# EAGLE design Shruthi-Analog-SSM2044-v02 (EAGLE 5.09)
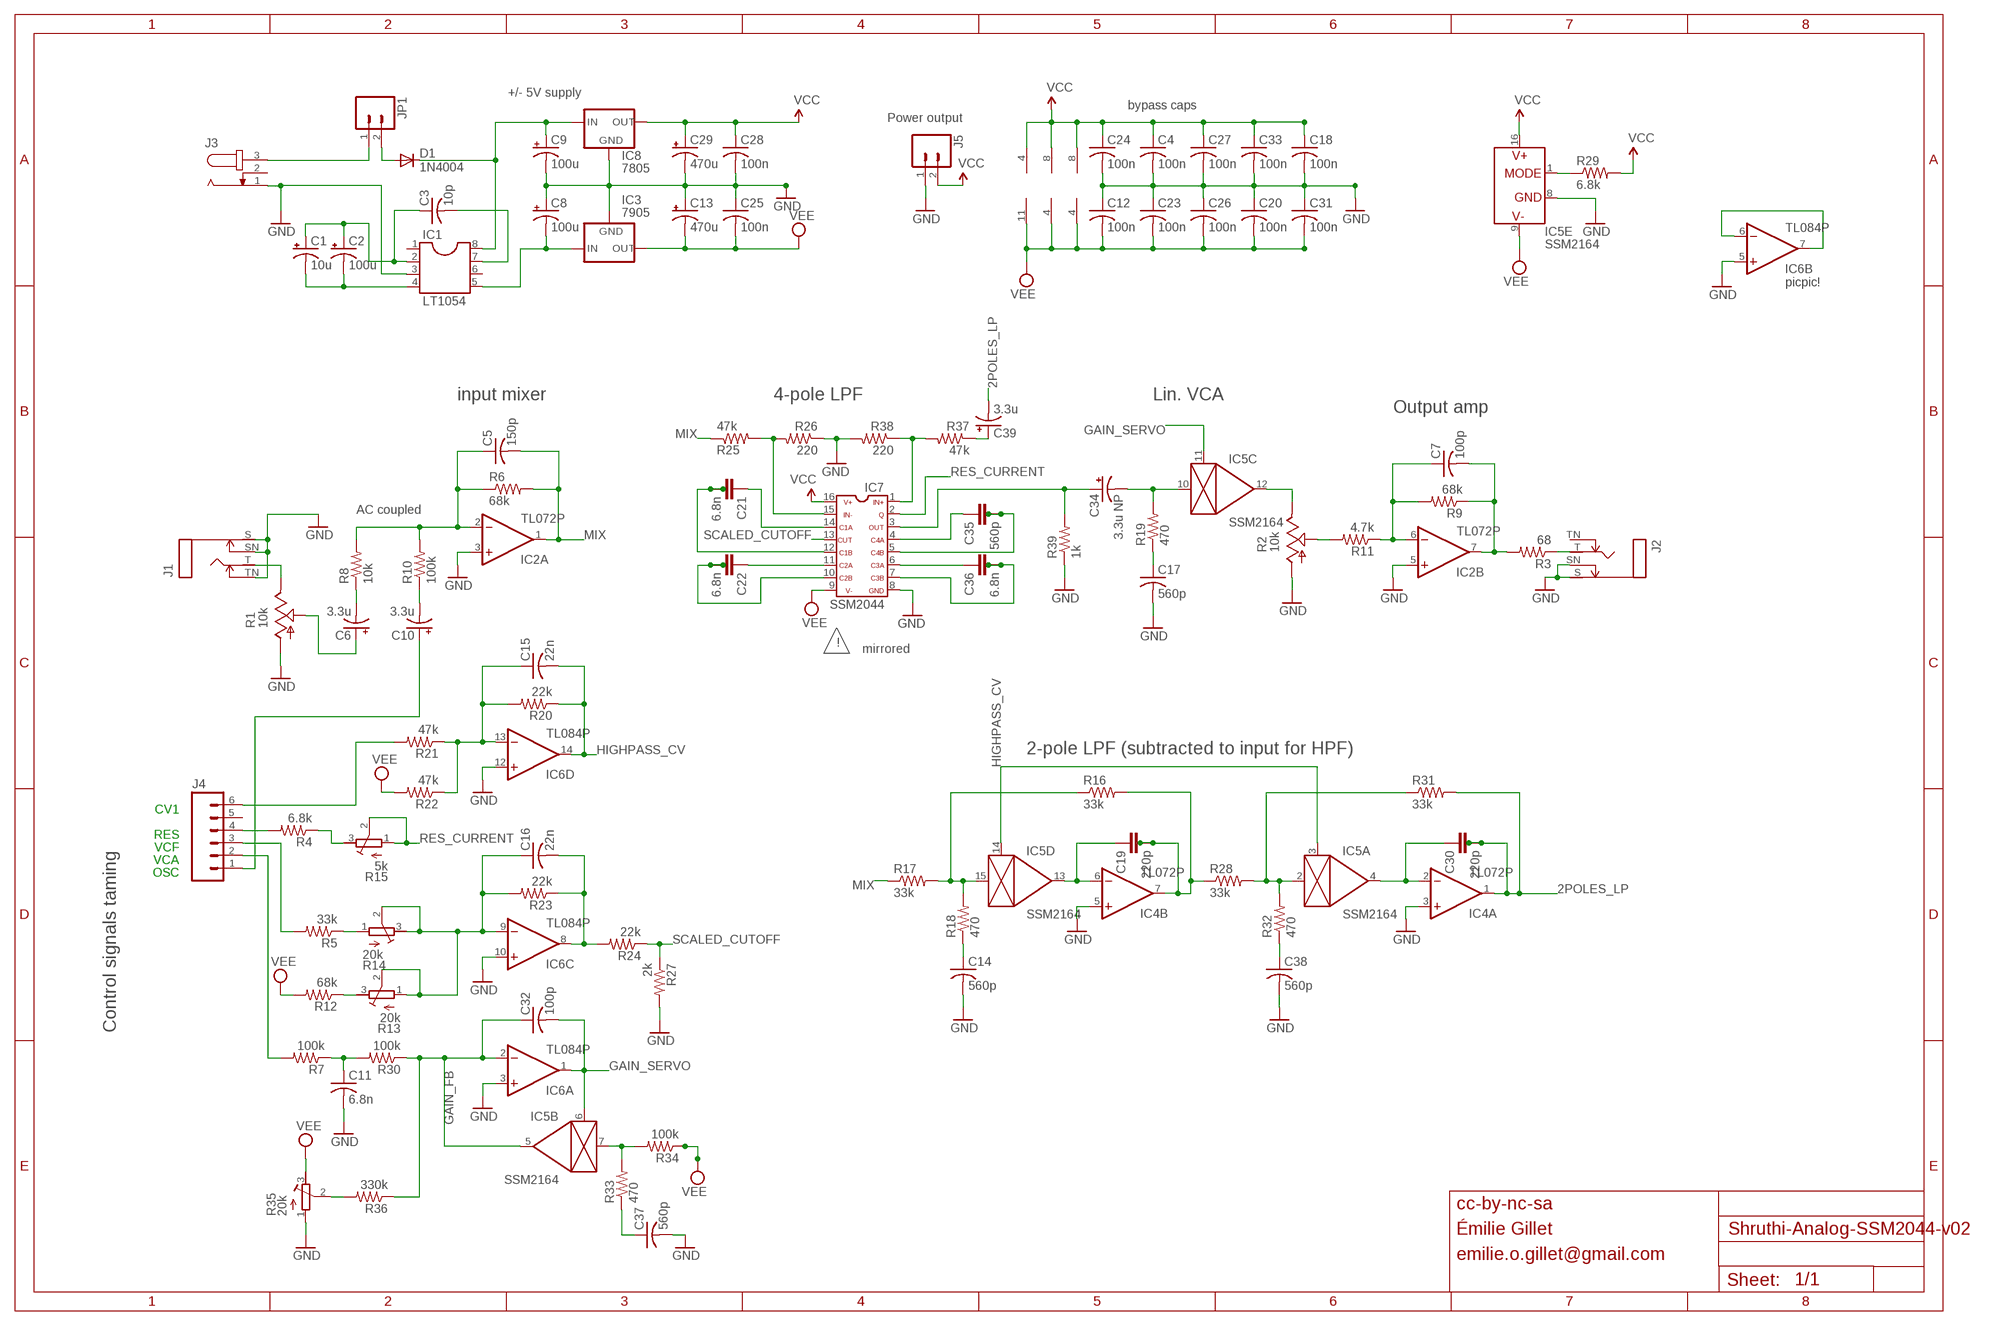
[diagram p0: schematic, sheet 1]

## Parts
C1  10u  CPOL-USE2.5-5  [E2,5-5]
C2  100u  CPOL-USE2.5-6  [E2,5-6]
C3  10p  C-US025-025X050  [C025-025X050]
C4  100n  C-US025-025X050  [C025-025X050]
C5  150p  C-US025-025X050  [C025-025X050]
C6  3.3u  CPOL-USE2.5-6  [E2,5-6]
C7  100p  C-US025-025X050  [C025-025X050]
C8  100u  CPOL-USE2.5-7  [E2,5-7]
C9  100u  CPOL-USE2.5-7  [E2,5-7]
C10  3.3u  CPOL-USE2.5-6  [E2,5-6]
C11  6.8n  C-US050-025X075  [C050-025X075]
C12  100n  C-US025-025X050  [C025-025X050]
C13  470u  CPOL-USE5-10.5  [E5-10,5]
C14  560p  C-US025-025X050  [C025-025X050]
C15  22n  C-US050-025X075  [C050-025X075]
C16  22n  C-US050-025X075  [C050-025X075]
C17  560p  C-US025-025X050  [C025-025X050]
C18  100n  C-US025-025X050  [C025-025X050]
C19  220p  C-2.5-5/4  [C2.5/5-4]
C20  100n  C-US025-025X050  [C025-025X050]
C21  6.8n  C-2.5-5/4  [C2.5/5-4]
C22  6.8n  C-2.5-5/4  [C2.5/5-4]
C23  100n  C-US025-025X050  [C025-025X050]
C24  100n  C-US025-025X050  [C025-025X050]
C25  100n  C-US025-025X050  [C025-025X050]
C26  100n  C-US025-025X050  [C025-025X050]
C27  100n  C-US025-025X050  [C025-025X050]
C28  100n  C-US025-025X050  [C025-025X050]
C29  470u  CPOL-USE5-10.5  [E5-10,5]
C30  220p  C-2.5-5/4  [C2.5/5-4]
C31  100n  C-US025-025X050  [C025-025X050]
C32  100p  C-US025-025X050  [C025-025X050]
C33  100n  C-US025-025X050  [C025-025X050]
C34  3.3u NP  CPOL-USE2.5-6  [E2,5-6]
C35  560p  C-2.5-5/4  [C2.5/5-4]
C36  6.8n  C-2.5-5/4  [C2.5/5-4]
C37  560p  C-US025-025X050  [C025-025X050]
C38  560p  C-US025-025X050  [C025-025X050]
C39  3.3u  CPOL-USE2.5-6  [E2,5-6]
D1  1N4004  [DO41-10]
IC1  LT1054  DIL8  [DIL08]
IC2  TL072P  [DIL08]
IC3  7905  79XXS  [79XXS]
IC4  TL072P  [DIL08]
IC5  SSM2164  SSM2164P  [DIL16]
IC6  TL084P  [DIL14]
IC7  SSM2044  SSM2044SOCKETED  [SOCKET-16]
IC8  7805  78XXS  [78XXS]
J1  MONOSWS  [NMJ4HC-S]
J2  MONOSWS  [NMJ4HC-S]
J3  JACK-PLUG  [SPC4078_LARGER_HOLES]
J4  M06SIP  [1X06]
J5  M02PTH  [1X02]
JP1  M02  [1X02_LONGPADS]
R1  10k  POT_USCABLED  [CABLE_POT_6MM]
R2  10k  POT_USCABLED  [CABLE_POT_6MM]
R3  68  R-US_0204/7  [0204/7]
R4  6.8k  R-US_0204/7  [0204/7]
R5  33k  R-US_0204/7  [0204/7]
R6  68k  R-US_0204/7  [0204/7]
R7  100k  R-US_0204/7  [0204/7]
R8  10k  R-US_0204/7  [0204/7]
R9  68k  R-US_0204/7  [0204/7]
R10  100k  R-US_0204/7  [0204/7]
R11  4.7k  R-US_0204/7  [0204/7]
R12  68k  R-US_0204/7  [0204/7]
R13  20k  R-TRIMM3296W  [RTRIM3296W]
R14  20k  R-TRIMM3296W  [RTRIM3296W]
R15  5k  R-TRIMM3296W  [RTRIM3296W]
R16  33k  R-US_0204/7  [0204/7]
R17  33k  R-US_0204/7  [0204/7]
R18  470  R-US_0204/7  [0204/7]
R19  470  R-US_0204/7  [0204/7]
R20  22k  R-US_0204/7  [0204/7]
R21  47k  R-US_0204/7  [0204/7]
R22  47k  R-US_0204/7  [0204/7]
R23  22k  R-US_0204/7  [0204/7]
R24  22k  R-US_0204/7  [0204/7]
R25  47k  R-US_0204/7  [0204/7]
R26  220  R-US_0204/7  [0204/7]
R27  2k  R-US_0204/7  [0204/7]
R28  33k  R-US_0204/7  [0204/7]
R29  6.8k  R-US_0204/7  [0204/7]
R30  100k  R-US_0204/7  [0204/7]
R31  33k  R-US_0204/7  [0204/7]
R32  470  R-US_0204/7  [0204/7]
R33  470  R-US_0204/7  [0204/7]
R34  100k  R-US_0204/7  [0204/7]
R35  20k  R-TRIMM3296W  [RTRIM3296W]
R36  330k  R-US_0204/7  [0204/7]
R37  47k  R-US_0204/7  [0204/7]
R38  220  R-US_0204/7  [0204/7]
R39  1k  R-US_0204/7  [0204/7]

## Nets
2POLES_LP: C30.2 C30.3 C39.- IC4.1(A:OUT) R31.2
GAIN_FB: C32.1 IC5.5(B:OUT) IC6.2(A:-IN) R30.1 R36.1
GAIN_SERVO: C32.2 IC5.6(B:CTRL) IC5.11(C:CTRL) IC6.1(A:OUT)
GND: C4.2 C8.+ C9.- C11.2 C12.1 C13.+ C14.2 C17.2 C18.2 C20.1 C23.1 C24.2 C25.1 C26.1 C27.2 C28.2 C29.- C31.1 C33.2 C37.2 C38.2 IC1.3 IC2.3(A:+IN) IC2.5(B:+IN) IC3.GND IC4.3(A:+IN) IC4.5(B:+IN) IC5.8(E:GND) IC6.3(A:+IN) IC6.5(B:+IN) IC6.10(C:+IN) IC6.12(D:+IN) IC7.8 IC8.GND J1.S J1.SN J1.TN J2.S J2.SN J3.1 J5.1 R1.A R2.A R26.1 R27.2 R35.1(E) R38.2 R39.1
HIGHPASS: C19.2 C19.3 IC4.7(B:OUT) R16.2 R28.1
HIGHPASS_CV: C15.2 IC5.3(A:CTRL) IC5.14(D:CTRL) IC6.14(D:OUT) R20.1
LOWPASS: C34.+ IC7.3 R39.2
MIX: C5.2 IC2.1(A:OUT) R6.2 R17.1 R25.1
N$1: C1.+ C2.+ C3.1 IC1.2
N$2: IC5.1(E:MODE) R29.1
N$3: J3.3 JP1.1
N$4: C9.+ D1.C IC1.8 IC8.IN
N$5: C1.- C2.- IC1.4
N$6: R2.S R11.2
N$7: J4.2 R7.2
N$8: C11.1 R7.1 R30.2
N$9: C34.- IC5.10(C:IN) R19.2
N$10: J4.4 R4.2
N$11: J4.3 R5.2
N$12: R12.1 R13.3(A)
N$13: R5.1 R14.1(E)
N$14: IC7.1 R37.2 R38.1
N$16: C16.2 IC6.8(C:OUT) R23.1 R24.2
N$17: C16.1 IC6.9(C:-IN) R13.1(E) R13.2(S) R14.2(S) R14.3(A) R23.2
N$18: J4.6 R21.2
N$19: C19.1 IC4.6(B:-IN) IC5.13(D:OUT)
N$20: C15.1 IC6.13(D:-IN) R20.2 R21.1 R22.1
N$21: C35.2 C35.3 IC7.5
N$22: C36.1 IC7.6
N$23: C22.1 IC7.11
N$24: R4.1 R15.3(A)
N$25: C35.1 IC7.4
N$26: C38.1 R32.1
N$27: C22.2 C22.3 IC7.10
N$28: C39.+ R37.1
N$29: C21.2 C21.3 IC7.12
N$30: IC7.15 R25.2 R26.2
N$31: C17.1 R19.1
N$32: C36.2 C36.3 IC7.7
N$33: IC5.15(D:IN) R16.1 R17.2 R18.2
N$34: IC5.12(C:OUT) R2.E
N$35: C10.+ J4.1
N$36: C3.2 IC1.7
N$37: C5.1 IC2.2(A:-IN) R6.1 R8.2 R10.2
N$38: J1.T R1.E
N$39: C10.- R10.1
N$40: C14.1 R18.1
N$41: IC5.7(B:IN) R33.2 R34.2
N$42: C37.1 R33.1
N$43: IC5.2(A:IN) R28.2 R31.1 R32.2
N$44: C21.1 IC7.14
N$45: R35.2(S) R36.2
N$46: C30.1 IC4.2(A:-IN) IC5.4(A:OUT)
N$47: J2.T R3.1
N$48: IC6.6(B:-IN) IC6.7(B:OUT)
N$58: C8.- IC1.5 IC3.IN
N$59: D1.A JP1.2
N$63: C7.2 IC2.7(B:OUT) R3.2 R9.1
N$66: C6.+ R1.S
N$70: C7.1 IC2.6(B:-IN) R9.2 R11.1
N$72: C6.- R8.1
RES_CURRENT: IC7.2 R15.1(E) R15.2(S)
SCALED_CUTOFF: IC7.13 R24.1 R27.1
VCC: C4.1 C18.1 C24.1 C27.1 C28.1 C29.+ C33.1 IC2.8(P:V+) IC4.8(P:V+) IC5.16(E:V+) IC6.4(P:V+) IC7.16 IC8.OUT J5.2 R29.2
VEE: C12.2 C13.- C20.2 C23.2 C25.2 C26.2 C31.2 IC2.4(P:V-) IC3.OUT IC4.4(P:V-) IC5.9(E:V-) IC6.11(P:V-) IC7.9 R12.2 R22.2 R34.1 R35.3(A)
Unconnected: IC1.1 IC1.6 J2.TN J3.2 J4.5

## Notes on the sheet
- +/- 5V supply
- bypass caps
- Power output
- picpic!
- input mixer | 4-pole LPF | Lin. VCA
- Output amp
- AC coupled
- !
- mirrored
- 2-pole LPF (subtracted to input for HPF)
- CV1
- RES
- VCF
- VCA
- OSC
- Control signals taming
- cc-by-nc-sa
- Émilie Gillet
- emilie.o.gillet@gmail.com

## Library data of the parts
C1 C2 C6 C8-C10 C13 C29 C34 C39 = rcl:CPOL-US: POLARIZED CAPACITOR, American symbol
C3-C5 C7 C11 C12 C14-C18 C20 C23-C28 C31-C33 C37 C38 = rcl:C-US: CAPACITOR, American symbol
C19 C21 C22 C30 C35 C36 = capacitor-wima:C-: CAPACITOR for alternative placement naming: default grid - extended grid/package width
D1 = diode:1N4004: DIODE general purpose rectifier, 1 A
IC1 = ic-package:DIL8: Dual In Line / Socket
IC2 IC4 = linear:TL072: OP AMP
IC3 = v-reg:79XXS: VOLTAGE REGULATOR
IC5 = ssm2164:SSM2164
IC6 = linear:TL084: OP AMP
IC7 = ssm:SSM2044: 4-pole VCF with VC-controlled resonance
IC8 = v-reg:78XXS: VOLTAGE REGULATOR
J1 J2 = gm-jacks:MONOSW
J3 = con-jack2:JACK-PLUG: DC POWER JACK Power Jack, DC, Right Angle, Through Hole, Rated 5A at 16VDC, PC Terminals Distributor: Farnell (www.Farnell.de) Drawing: 84N1161.pdf / 84N1162.pdf Manufacturer: SPC Technology (www.spctechnology.com) Type: SPC4077 / SPC 4078
J4 = SparkFun:M06: Header 6 Standard 6-pin 0.1" header. Use with straight break away headers (SKU : PRT-00116), right angle break away headers (PRT-00553), swiss pins (PRT-00743), machine pins (PRT-00117), and female headers (PRT-00115). Molex polarized connector foot print use with SKU : PRT-08094 with associated crimp pins and housings. NOTES ON THE VARIANTS LOCK and LOCK_LONGPADS... This footprint was designed to help hold the alignment of a through-hole component (i.e. 6-pin header) while soldering it into place. You may notice that each hole has been shifted either up or down by 0.005 of an inch from it's more standard position (which is a perfectly straight line). This slight alteration caused the pins (the squares in the middle) to touch the edges of the holes. Because they are alternating, it causes a "brace" to hold the component in place. 0.005 has proven to be the perfect amount of "off-center" position when using our standard breakaway headers. Although looks a little odd when you look at the bare footprint, once you have a header in there, the alteration is very hard to notice. Also, if you push a header all the way into place, it is covered up entirely on the bottom side. This idea of altering the position of holes to aid alignment will be further integrated into the Sparkfun Library for other footprints. It can help hold any component with 3 or more connection pins.
J5 JP1 = SparkFun:M02: Header 2 Standard 2-pin 0.1" header. Use with straight break away headers (SKU : PRT-00116), right angle break away headers (PRT-00553), swiss pins (PRT-00743), machine pins (PRT-00117), and female headers (PRT-00115). Molex polarized connector foot print use with SKU : PRT-08233 with associated crimp pins and housings.
R1 R2 = pot-cable:POT_US
R3-R12 R16-R34 R36-R39 = rcl:R-US_: RESISTOR, American symbol
R13-R15 R35 = rcl:R-TRIMM: Trimm resistor

## Board
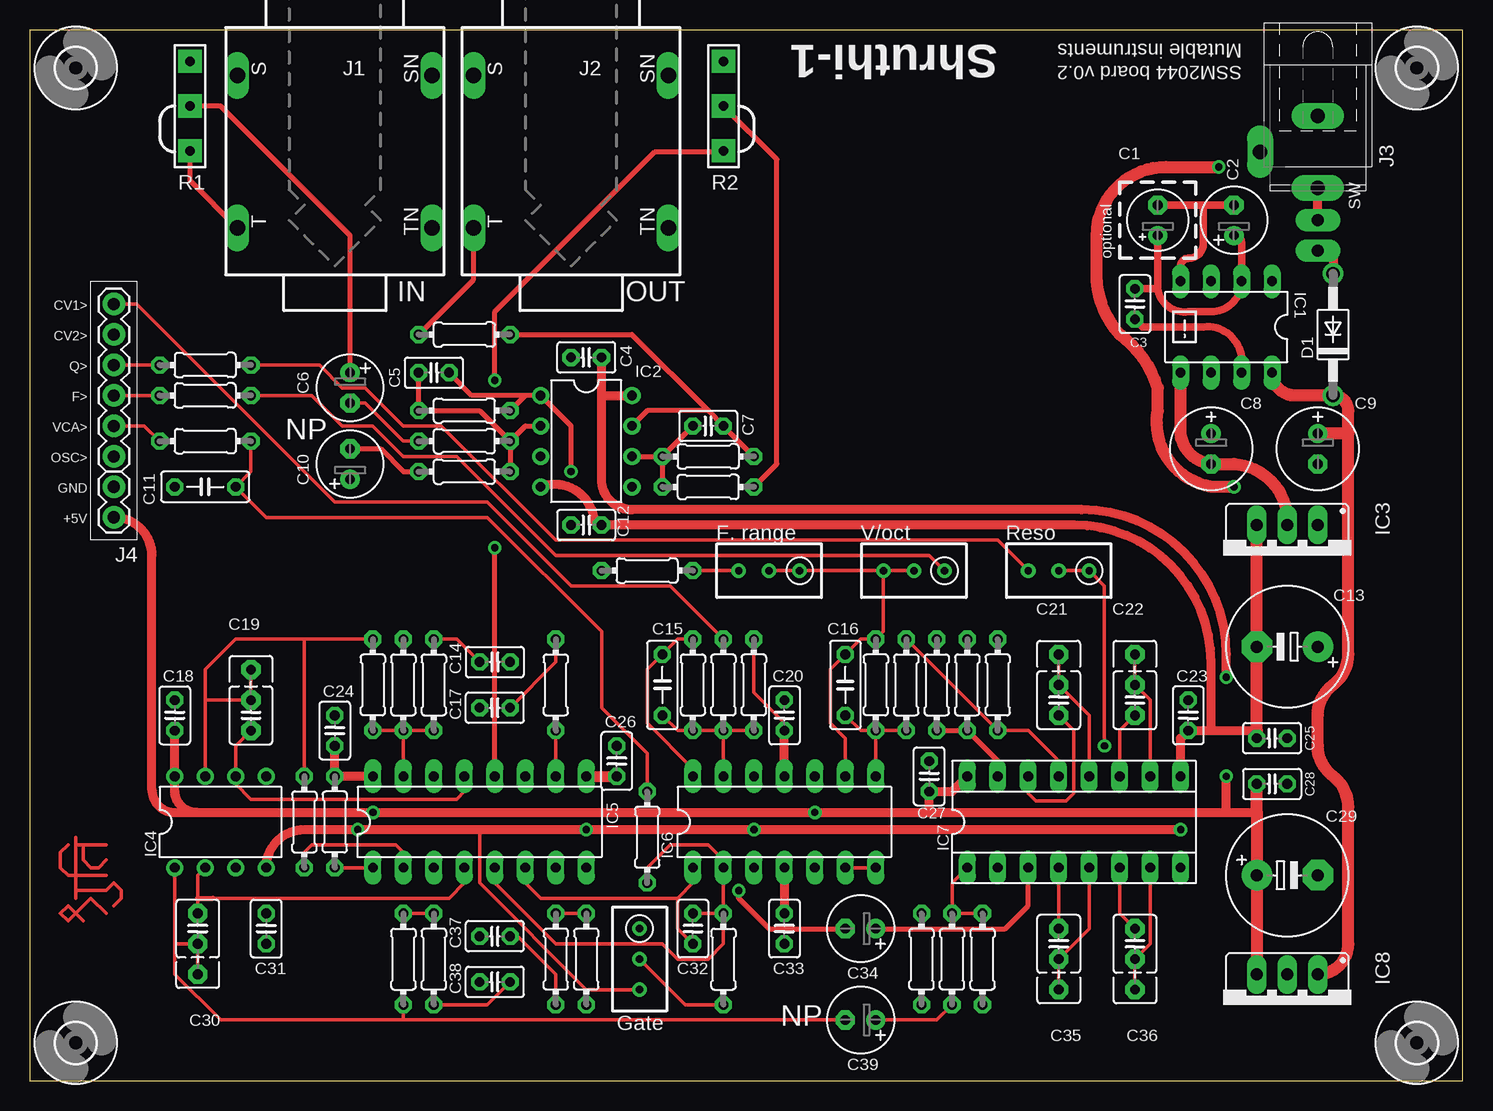
[diagram p1: board, top side]
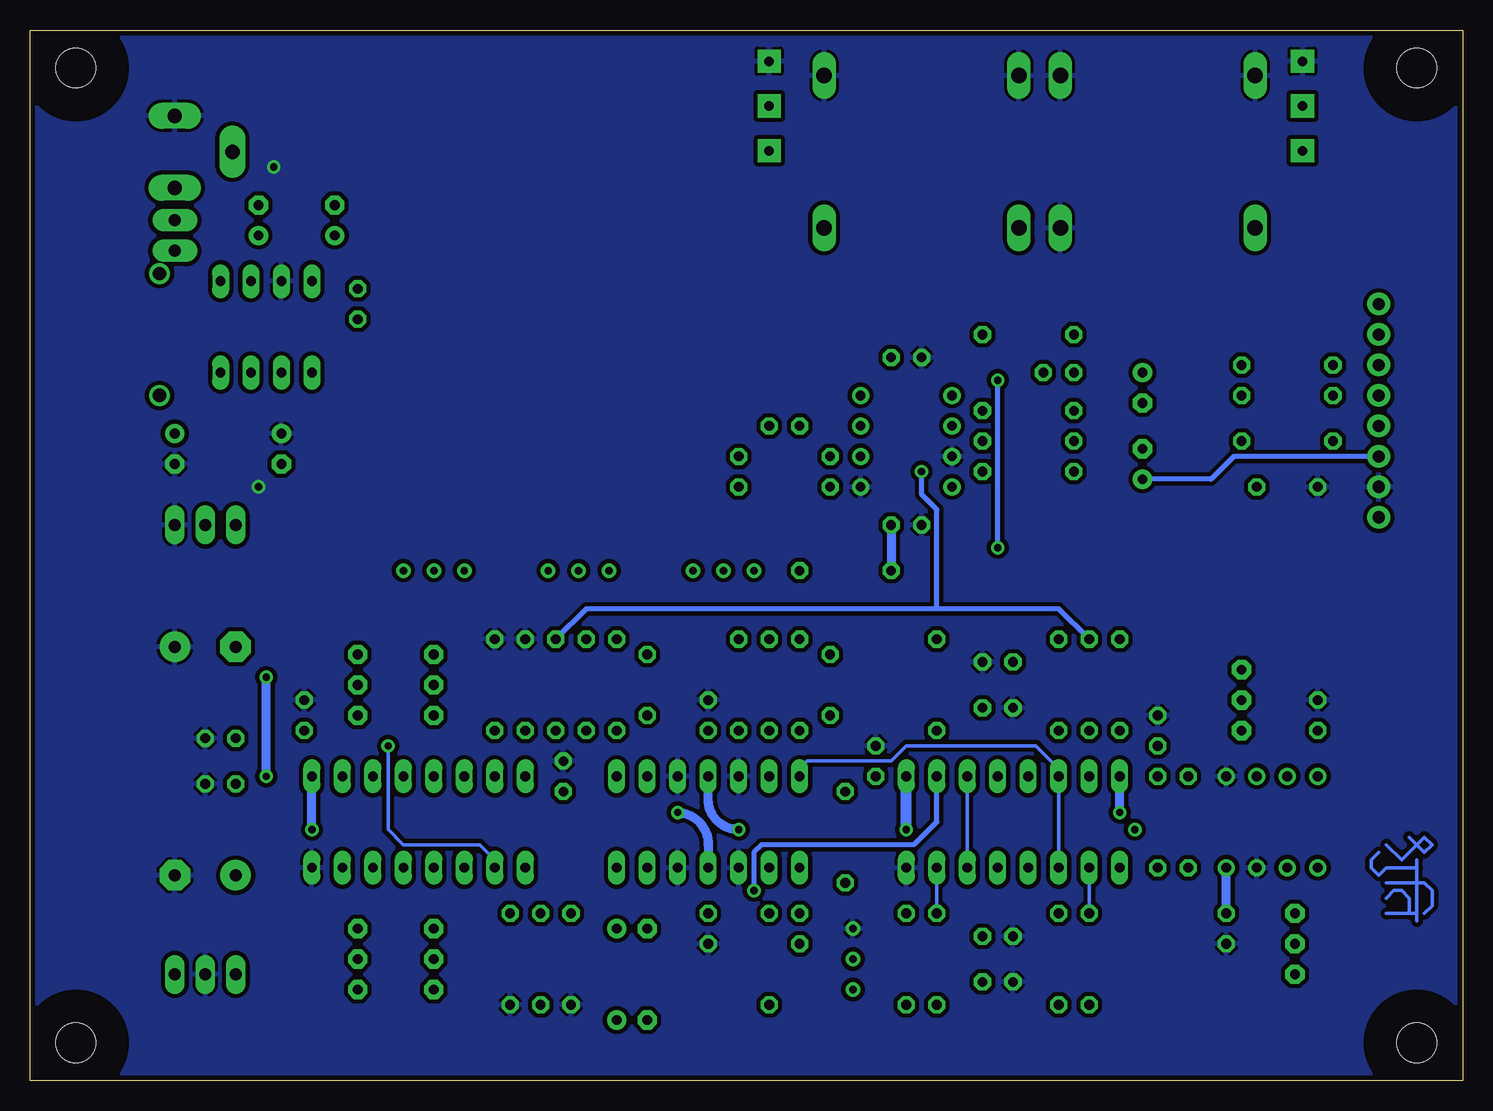
[diagram p2: board, bottom side, seen from below]

Size 119.38 x 87.62 mm. Coordinates in mm from the lower left corner, seen from the top.
Outline: 0,0 119.38,0 119.38,87.62 0,87.62 0,0
Copper layers (1*16): Top 0.035mm / dielectric 1.5mm / Bottom 0.035mm
Design rules "SparkFun_10mil": minimum track width 10mil, minimum drill 20mil, track to track 10mil, track to pad 10mil, pad to pad 10mil, via to via 10mil, smd to smd 10mil, copper to edge 10mil, drill to drill 10mil, minimum pad ring 12mil, minimum via ring 10mil, stop-mask expansion 4mil, vias tented up to drill 25mil, thermal gap 10mil

### Footprints (pad centres in the part's own frame; a part is rotated, then mirrored left to right if it is on the bottom)
E2,5-5 = drill 0.813 pad 1.6 round: + -1.27,0 | drill 0.813 pad 1.6 octagon: - 1.27,0
E2,5-6 = drill 0.813 pad 1.6 round: + -1.27,0 | drill 0.813 pad 1.6 octagon: - 1.27,0
C025-025X050 = drill 0.813 octagon: 1 -1.27,0; 2 1.27,0
E2,5-7 = drill 0.813 pad 1.6 round: + -1.27,0 | drill 0.813 pad 1.6 octagon: - 1.27,0
C050-025X075 = drill 0.813 octagon: 1 -2.54,0; 2 2.54,0
E5-10,5 = drill 1.016 pad 2.54 round: + -2.54,0 | drill 1.016 pad 2.54 octagon: - 2.54,0
C2.5/5-4 = drill 0.813 pad 1.6 octagon: 1 -1.27,0; 2 1.27,0; 3 3.81,0
DO41-10 = drill 1.118 round: A 5.08,0; C -5.08,0
DIL08 = drill 0.813 long: 1 -3.81,-3.81; 2 -1.27,-3.81; 3 1.27,-3.81; 4 3.81,-3.81; 5 3.81,3.81; 6 1.27,3.81; 7 -1.27,3.81; 8 -3.81,3.81
DIL08' = drill 0.813 pad 1.27 round: 1 -3.81,-3.81; 2 -1.27,-3.81; 3 1.27,-3.81; 4 3.81,-3.81; 5 3.81,3.81; 6 1.27,3.81; 7 -1.27,3.81; 8 -3.81,3.81
79XXS = drill 1.016 long: GND -2.54,-2.54; IN 0,-2.54; OUT 2.54,-2.54
DIL16 = drill 0.813 long: 1 -8.89,-3.81; 2 -6.35,-3.81; 3 -3.81,-3.81; 4 -1.27,-3.81; 5 1.27,-3.81; 6 3.81,-3.81; 7 6.35,-3.81; 8 8.89,-3.81; 9 8.89,3.81; 10 6.35,3.81; 11 3.81,3.81; 12 1.27,3.81; 13 -1.27,3.81; 14 -3.81,3.81; 15 -6.35,3.81; 16 -8.89,3.81
DIL14 = drill 0.813 long: 1 -7.62,-3.81; 2 -5.08,-3.81; 3 -2.54,-3.81; 4 0,-3.81; 5 2.54,-3.81; 6 5.08,-3.81; 7 7.62,-3.81; 8 7.62,3.81; 9 5.08,3.81; 10 2.54,3.81; 11 0,3.81; 12 -2.54,3.81; 13 -5.08,3.81; 14 -7.62,3.81
SOCKET-16 = drill 0.813 long: 1 -8.89,-3.81; 2 -6.35,-3.81; 3 -3.81,-3.81; 4 -1.27,-3.81; 5 1.27,-3.81; 6 3.81,-3.81; 7 6.35,-3.81; 8 8.89,-3.81; 9 8.89,3.81; 10 6.35,3.81; 11 3.81,3.81; 12 1.27,3.81; 13 -1.27,3.81; 14 -3.81,3.81; 15 -6.35,3.81; 16 -8.89,3.81
78XXS = drill 1.016 long: GND 0,-2.54; IN -2.54,-2.54; OUT 2.54,-2.54
NMJ4HC-S = drill 1.3 long: S 5.08,8.115; SN 5.08,-8.115; T -7.62,8.115; TN -7.62,-8.115
SPC4078_LARGER_HOLES = drill 1.2 pad 2.184 long: 1 -3,0; 2 0,-4.8; 3 3,0
1X06 = drill 1.016 pad 1.88 round: 1 0,0; 2 2.54,0; 3 5.08,0; 4 7.62,0; 5 10.16,0; 6 12.7,0
1X02 = drill 1.016 pad 1.88 round: 1 0,0; 2 2.54,0
1X02_LONGPADS = drill 1.016 pad 1.88 long: 1 0,0; 2 2.54,0
CABLE_POT_6MM = drill 0.8 pad 1.93 square: A -3.73,0; E 3.73,0; S 0,0
0204/7 = drill 0.813 octagon: 1 -3.81,0; 2 3.81,0
RTRIM3296W = drill 0.61 round: 1 0,-2.54; 2 0,0; 3 0,2.54
3,3 = hole 3.3: 0,0

### Placement (x,y rotation side)
C1  93.98,71.75 90 top
C2  100.33,71.75 90 top
C3  92.08,64.77 270 top
C4  46.35,60.33 180 top
C5  33.66,59.05 0 top
C6  26.67,57.79 270 top
C7  56.52,54.61 0 top
C8  98.42,52.71 270 top
C9  107.31,52.71 270 top
C10  26.67,51.44 90 top
C11  14.61,49.53 180 top
C12  46.35,46.36 0 top
C13  104.78,36.2 180 top
C14  38.73,34.92 0 top
C15  52.7,33.02 90 top
C16  67.95,33.02 270 top
C17  38.73,31.11 180 top
C18  12.07,30.48 90 top
C19  18.41,30.48 90 top
C20  62.87,30.48 270 top
C21  85.72,31.75 90 top
C22  92.08,31.75 90 top
C23  96.52,30.48 270 top
C24  25.4,29.21 90 top
C25  103.5,28.57 180 top
C26  48.89,26.67 270 top
C27  74.93,25.4 90 top
C28  103.5,24.76 0 top
C29  104.78,17.14 0 top
C30  13.97,12.7 270 top
C31  19.68,12.7 90 top
C32  55.24,12.7 270 top
C33  62.87,12.7 270 top
C34  69.22,12.7 180 top
C35  85.72,11.43 270 top
C36  92.08,11.43 270 top
C37  38.73,12.07 180 top
C38  38.73,8.26 180 top
C39  69.22,5.08 180 top
D1  108.58,62.23 90 top
IC1  99.69,62.87 180 top
IC2  TL072P  [DIL08']  46.35,53.34 270 top
IC3  104.78,43.82 180 top
IC4  TL072P  [DIL08']  15.88,21.59 0 top
IC5  37.47,21.59 0 top
IC6  62.87,21.59 0 top
IC7  87,21.59 0 top
IC8  104.78,6.35 180 top
J1  25.4,78.74 90 top
J2  45.09,78.74 90 top
J3  107.31,77.47 270 top
J4  6.99,52.07 90 top
J5  6.99,49.53 270 top
JP1  107.31,71.75 270 top
R1  13.34,81.28 270 top
R2  57.78,81.28 270 top
R3  36.2,62.23 0 top
R4  14.61,59.69 180 top
R5  14.61,57.15 180 top
R6  36.2,55.88 0 top
R7  14.61,53.34 180 top
R8  36.2,53.34 0 top
R9  56.52,52.07 180 top
R10  36.2,50.8 0 top
R11  56.52,49.53 0 top
R12  51.44,42.55 180 top
R13  61.59,42.55 90 top
R14  73.66,42.55 90 top
R15  85.72,42.55 90 top
R16  28.57,33.02 90 top
R17  31.11,33.02 270 top
R18  33.66,33.02 270 top
R19  43.81,33.02 270 top
R20  55.24,33.02 270 top
R21  57.78,33.02 90 top
R22  60.33,33.02 90 top
R23  70.48,33.02 90 top
R24  73.03,33.02 270 top
R25  75.56,33.02 270 top
R26  78.11,33.02 270 top
R27  80.64,33.02 90 top
R28  22.86,21.59 270 top
R29  25.4,21.59 90 top
R30  51.44,20.32 90 top
R31  31.11,10.16 270 top
R32  33.66,10.16 90 top
R33  43.81,10.16 90 top
R34  46.35,10.16 90 top
R35  50.8,10.16 180 top
R36  57.78,10.16 270 top
R37  76.83,10.16 90 top
R38  79.38,10.16 270 top
R39  74.3,10.16 90 top
U$1  [3,3]  3.81,84.45 0 top
U$2  [3,3]  115.57,84.45 0 top
U$5  [3,3]  3.81,3.17 0 top
U$6  [3,3]  115.57,3.17 0 top
U$7  [RADHA_PEACOCK]  73.66,70.48 160 top

### Tracks (layer width: path | path; a pad name or v marks a point on that pad's centre or on a via)
2POLES_LP
  Top 0.305: 31.11,5.08 C39.- | 31.11,5.08 R31.2 | 31.11,5.08 15.88,5.08 12.07,8.89 12.07,11.43 | 12.07,11.43 IC4.1 | 12.07,11.43 C30.2 C30.3
GAIN_FB
  Top 0.305: IC5.5 38.73,16.51 43.81,11.43 52.7,11.43 53.98,10.16 56.52,10.16 57.78,11.43 R36.1 | R30.1 51.44,17.78 53.34,19.68 56.52,19.68 57.78,18.41 IC6.2 R36.1 | R36.1 C32.1
GAIN_SERVO
  Top 0.305: IC5.6 41.27,16.51 42.55,15.24 53.98,15.24 | 53.98,15.24 55.24,16.51 IC6.1 | 53.98,15.24 53.98,12.7 C32.2
  Bottom 0.305: IC5.6 IC5.11
GND  (via drill 0.6)
  Top 1.016: v99.06,76.2 94.65,76.2 arc90 88.9,70.45 88.9,66.67 arc37 90.8,62.23 arc-37 93.98,57.79 93.98,55.88 arc90 98.42,49.53 v100.33,49.53
  pour Bottom (isolate 0.356): 0.64,87 0.64,0.64 118.75,0.64 118.75,87
HIGHPASS
  Top 0.305: 22.86,36.83 R16.2 | 22.86,36.83 R28.1 | 22.86,36.83 17.14,36.83 14.61,34.29 14.61,31.75 | IC4.7 14.61,31.75 | 14.61,31.75 C19.2 C19.3
HIGHPASS_CV
  Top 0.305: IC6.14 55.24,26.04 51.44,29.84 51.44,34.29 C15.2 53.98,36.83 R20.1
  Bottom 0.305: IC5.3 IC5.14 33.66,26.04 35.56,27.94 46.35,27.94 47.62,26.67 54.61,26.67 55.24,26.04 IC6.14
LOWPASS
  Top 0.406: IC7.3 83.19,14.61 81.28,12.7 74.3,12.7 | C34.+ 74.3,12.7 | 74.3,12.7 R39.2
MIX  (via drill 0.6)
  Top 0.406: R6.2 41.27,57.15 IC2.1 | C5.2 36.83,57.15 IC2.1 | v45.09,50.8 45.09,54.61 IC2.1
  Bottom 0.406: R17.1 33.66,39.37 43.81,39.37 | 43.81,39.37 73.03,39.37 R25.1 | 43.81,39.37 43.81,47.62 45.09,48.9 v45.09,50.8
N$1
  Top 0.61: C2.+ arc-90 100.97,69.85 IC1.2 arc-90 98.42,64.14 96.52,64.14 arc-90 93.98,66.04 | 93.98,66.04 C1.+ | C3.1 93.98,66.04
N$2
  Top 0.305: R29.1 IC5.1
N$3
  Top 0.762: JP1.1 J3.3
N$4
  Top 1.016: IC8.IN arc90 109.86,11.43 109.86,22.86 arc53 108.58,25.4 arc-53 107.31,27.94 107.31,30.48 arc-53 108.58,33.02 arc53 109.86,35.56 109.86,53.98 | 109.86,53.98 109.86,55.88 arc90 D1.C 105.41,57.15 arc-90 IC1.8 | 109.86,53.98 C9.+
N$5
  Top 0.61: 97.79,73.03 C1.- | 97.79,73.03 C2.- | IC1.4 95.89,67.95 arc-90 96.52,68.58 arc90 97.79,69.85 97.79,73.03
N$6
  Top 0.406: R11.2 62.23,51.44 62.23,76.84 R2.S
N$7
  Top 0.305: J4.2 9.53,54.61 R7.2
N$8
  Top 0.305: R7.1 18.41,50.8 C11.1 19.68,46.99 38.1,46.99 47.62,37.47 47.62,31.11 51.44,27.3 R30.2
N$9  (via drill 0.6)
  Top 0.305: IC5.10 R19.2
  Top 0.406: C34.- 61.59,12.7 59.05,15.24 v59.05,15.88
  Bottom 0.406: v59.05,15.88 59.05,19.05 58.42,19.68 45.72,19.68 43.81,21.59 IC5.10
N$10
  Top 0.305: J4.4 R4.2
N$11
  Top 0.305: J4.3 R5.2
N$12
  Top 0.305: R12.1 R13.3
N$13
  Top 0.305: R5.1 23.5,57.15 26.04,54.61 28.57,54.61 31.11,52.07 35.56,52.07 43.81,43.82 74.93,43.82 R14.1
N$14
  Top 0.305: IC7.1 76.83,16.51 R37.2 R38.1
N$15
  Bottom 0.305: 6.35,19.68 5.08,18.41 3.18,20.32 2.54,19.68 3.18,19.05 4.45,20.32
N$16
  Top 0.305: R23.1 R24.2 | R23.1 69.22,29.21 C16.2 | IC6.8 R23.1
N$17
  Top 0.305: IC6.9 67.95,28.57 66.67,29.84 66.67,34.29 C16.1 69.22,36.83 R23.2 71.12,37.47 R14.3 | R13.2 R13.1 R14.3 | R14.3 R14.2
N$18
  Top 0.305: J4.6 8.89,64.77 25.4,48.26 38.1,48.26 45.09,41.28 53.34,41.28 R21.2
N$19
  Top 0.305: IC5.13 36.2,24.13 35.56,23.49 18.41,23.49 17.14,24.76 IC4.6 17.14,27.94 C19.1
N$20
  Top 0.305: IC6.13 R21.1 | R21.1 R22.1 | R21.1 R20.2 53.98,29.21 C15.1
N$21
  Top 0.305: C35.3 C35.2 88.27,12.7 IC7.5
N$22
  Top 0.305: IC7.6 90.8,13.97 C36.1
N$23
  Top 0.305: IC7.11 90.8,29.21 C22.1
N$24
  Top 0.305: R4.1 24.13,59.69 26.04,57.79 27.94,57.79 31.11,54.61 34.29,54.61 43.81,45.09 80.64,45.09 R15.3
N$25
  Top 0.305: C35.1 IC7.4
N$26
  Top 0.305: R32.1 38.1,6.35 C38.1
N$27
  Top 0.305: C22.3 C22.2 93.34,31.75 IC7.10
N$28
  Top 0.305: C39.+ 75.56,5.08 R37.1
N$29
  Top 0.305: C21.3 C21.2 88.27,30.48 IC7.12
N$30
  Top 0.406: R25.2 R26.2 80.64,26.67 IC7.15
N$31
  Top 0.305: C17.1 43.81,34.92 R19.1
N$32
  Top 0.305: C36.3 C36.2 93.34,11.43 IC7.7
N$33
  Top 0.305: R17.2 R16.1 | R17.2 R18.2 | IC5.15 R17.2
N$34  (via drill 0.6)
  Top 0.406: R2.E 57.7,77.47 52.07,77.47 38.73,64.14 v38.73,58.42 | IC5.12 v38.73,44.45
  Bottom 0.406: v38.73,44.45 v38.73,58.42
N$35
  Bottom 0.406: C10.+ 20.96,50.16 19.05,52.07 J4.1
N$36
  Top 0.61: IC1.7 100.97,60.33 arc90 97.79,62.87 92.71,62.87 C3.2
N$37
  Top 0.406: R8.2 41.27,54.61 IC2.2 | R8.2 R10.2 | R8.2 37.47,55.88 R6.1 C5.1
N$38
  Top 0.406: J1.T 13.34,75.07 R1.E
N$39
  Top 0.406: C10.- 29.21,52.71 31.11,50.8 R10.1
N$40
  Top 0.305: R18.1 35.56,36.83 C14.1
N$41
  Top 0.305: R33.2 R34.2
  Bottom 0.305: R33.2 IC5.7
N$42
  Top 0.305: C37.1 40.64,12.07 43.81,8.89 R33.1
N$43
  Top 0.305: R31.1 R32.2 | R28.2 22.86,19.05 23.5,19.68 30.48,19.68 31.11,19.05 IC5.2
  Bottom 0.305: IC5.2 R31.1
N$44
  Top 0.305: C21.1 87,29.21 87,23.97 86.36,23.33 83.82,23.33 83.19,23.97 IC7.14
N$45
  Top 0.305: R35.2 54.61,6.35 R36.2
N$46
  Top 0.305: C30.1 13.97,15.24 13.97,17.14 IC4.2 | IC5.4 36.2,16.51 34.93,15.24 15.24,15.24
  Top 0.406: 13.97,15.24 15.24,15.24
N$47
  Top 0.406: R3.1 36.97,66.81 J2.T
N$48
  Top 0.305: IC6.6 IC6.7
N$52
  Bottom 0.305: 3.81,17.78 3.81,18.41 | 3.81,16.51 3.81,17.78 | 3.81,13.97 3.81,16.51 | 3.81,13.34 3.81,13.97 | 4.45,13.97 6.35,13.97 | 3.81,13.97 4.45,13.97 | 4.45,13.97 4.45,15.24 5.08,15.88 5.71,15.88 6.35,15.24 | 3.81,17.78 6.35,17.78 6.99,17.14 7.62,17.78 7.62,18.41 6.99,19.05 | 3.81,16.51 6.35,16.51 | 3.81,16.51 3.18,16.51 2.54,15.88 2.54,14.61 3.18,13.97
N$53
  Top 0.305: 6.35,13.97 5.08,15.24 3.18,13.34 2.54,13.97 3.18,14.61 4.45,13.34
N$54
  Top 0.305: 3.81,15.88 3.81,15.24 | 3.81,15.88 3.81,17.14 | 3.81,17.14 3.81,19.68 | 3.81,19.68 3.81,20.32 | 4.45,19.68 6.35,19.68 | 3.81,19.68 4.45,19.68 | 4.45,19.68 4.45,18.41 5.08,17.78 5.71,17.78 6.35,18.41 | 3.81,15.88 6.35,15.88 6.99,16.51 7.62,15.88 7.62,15.24 6.99,14.61 | 3.81,17.14 6.35,17.14 | 3.81,17.14 3.18,17.14 2.54,17.78 2.54,19.05 3.18,19.68
N$58
  Top 1.016: IC1.5 95.89,54.61 arc90 C8.- 100.33,51.44 arc-90 IC3.IN
N$59
  Top 0.762: JP1.2 arc-90 108.58,68.58 D1.A
N$63
  Top 0.406: R9.1 C7.2 56.52,55.88 | 56.52,55.88 50.16,62.23 R3.2 | IC2.7 51.44,55.88 56.52,55.88
N$66
  Top 0.406: R1.S 15.88,81.28 26.67,70.48 C6.+
N$70
  Top 0.406: IC2.6 R9.2 | R9.2 R11.1 | R9.2 C7.1
N$72
  Top 0.305: C6.- 27.94,56.52 31.11,53.34 R8.1
RES_CURRENT  (via drill 0.6)
  Top 0.305: v89.53,27.94 89.53,40.64 89.53,41.28 R15.1 R15.2
  Bottom 0.305: v89.53,27.94 89.53,20.95 88.27,19.68 81.92,19.68 80.64,18.41 IC7.2
SCALED_CUTOFF
  Top 0.305: R24.1 R27.1 83.19,29.21 85.72,26.67 IC7.13
VCC  (via drill 0.6)
  Top 0.61: IC8.OUT C29.+
  Top 0.762: 13.97,22.38 v28.57,22.38 v65.41,22.38 74.93,22.38 | 74.93,22.38 99.69,22.38 | 99.69,22.38 102.23,22.38 | 13.97,22.38 arc-90 12.07,24.13 IC4.8 C18.1 | 74.93,22.38 C27.1 76.83,24.13 IC7.16 | IC6.4 C33.1 | C24.1 R29.2 IC5.16 | 13.97,22.38 12.07,22.38 arc-90 10.16,24.29 10.16,43.82 arc90 J5.2 | 47.62,57.15 47.62,50.16 arc90 50.16,47.62 87.63,47.62 arc-90 99.69,35.56 v99.69,33.66 | 47.62,57.15 C4.1 | 99.69,22.38 v99.69,25.4 | 47.62,57.15 IC2.8
  Top 1.016: IC8.OUT 102.23,22.38 C28.1
  Bottom 0.254: C28.1 102.23,24.13
  Bottom 0.762: IC6.4 62.87,19.68 arc-90 v65.41,22.38 | v99.69,25.4 v99.69,33.66 | v28.57,22.38 IC5.16
VEE  (via drill 0.6)
  Top 0.305: C20.2 62.87,29.84 60.33,32.38 R22.2 | 46.35,7.62 R34.1 | 46.35,7.62 37.47,16.51 37.47,20.95 | 46.35,7.62 R35.3
  Top 0.762: v95.89,20.95 v60.33,20.95 v46.35,20.95 37.47,20.95 v27.3,20.95 22.86,20.95 arc90 IC4.4 | 98.42,29.21 C23.2 95.89,28.57 IC7.9 | 98.42,29.21 102.23,29.21 | IC6.11 C20.2 | 98.42,29.21 98.42,34.92 arc90 87,46.36 C12.2 arc-90 46.99,46.99 arc100 IC2.4
  Top 0.914: IC5.9 C26.2
  Top 1.016: C25.2 102.23,29.21 C13.- IC3.OUT
  Bottom 0.762: v95.89,20.95 IC7.9 | IC6.11 62.87,23.49 arc-90 v60.33,20.95 | C31.2 IC4.4 | C12.2 R12.2
  Bottom 0.914: v46.35,20.95 IC5.9

### Text on the board
tPlace: Mutable instruments | CV1> | CV2> | Q> | F> | VCA> | OSC> | GND | +5V
tNames: Shruthi-1 | SSM2044 board v0.2 | SW | optional | IN | OUT | NP | F. range | V/oct | Reso | NP | Gate